# Altium schematic sheet Pre_Amplifier.SchDoc: Pre Amplifier
size A4; DrawnBy: Sem Kirkels; DocumentNumber: 22-23P01S01; Revision: V1; SheetNumber: 1; SheetTotal: 5
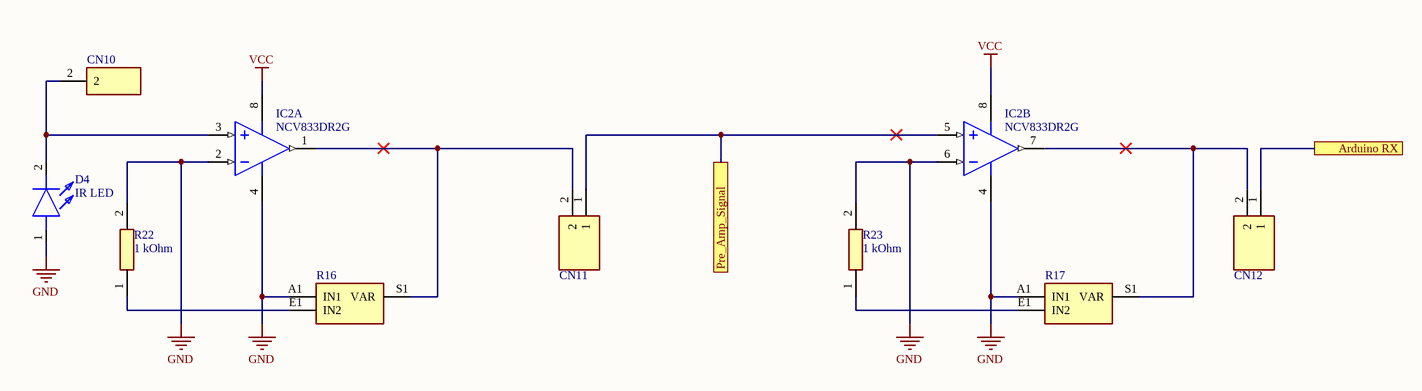
[diagram p0: Pre_Amplifier.SchDoc]

## Parts
CN10  1 Pin Header  [1 PIN HEADER]  (value not drawn)
CN11  2 Pin Header  [2 Pin Header]  (value not drawn)
CN12  2 Pin Header  [2 Pin Header]  (value not drawn)
D4  IR LED  [ELIR204H16L10]
IC2  NCV833DR2G  [Footprint Opamp]  (parts A,B of 2)
R16  PT10LV10-202A2020-S  [Variable resistor]  (value not drawn)
R17  PT10LV10-202A2020-S  [Variable resistor]  (value not drawn)
R22  1 kOhm  [0805]
R23  1 kOhm  [0805]

## Ports
Arduino RX (see CPU[2B]), Pre_Amp_Signal (see Amplifier[1A], Amplifier[1C], Amplifier[2A], Amplifier[2C])

## Nets
GND: D4.1(A) IC2.2(IN1-) IC2.4(VEE) IC2.6(IN2-) R16.A1(IN1) R17.A1(IN1) R22.2 R23.2
VCC: IC2.8(VCC)
Arduino RX: CN12.1 ; port Arduino RX
Pre_Amp_Signal: CN11.1 IC2.5(IN2+) ; port Pre_Amp_Signal
NetCN10_2: CN10.2 D4.2(K) IC2.3(IN1+)
NetCN11_2: CN11.2 IC2.1(OUT1) R16.S1(VAR)
NetCN12_2: CN12.2 IC2.7(OUT2) R17.S1(VAR)
NetR16_E1: R16.E1(IN2) R22.1
NetR17_E1: R17.E1(IN2) R23.1

## Library data of the parts
CN10 = 1 Pin Header: Connector; Manufacturer_Name: TE Connectivity; Manufacturer_Part_Number: 5-146281-1; Datasheet Link: https://www.mouser.com/datasheet/2/418/NG_CD_146281_G1-1238634.pdf; Height: 8.81mm; Mouser Part Number: 571-5-146281-1; Mouser Price/Stock: https://www.mouser.co.uk/ProductDetail/TE-Connectivity/5-146281-1?qs=bwpFY26eRVdQbbdvDiYEig%3D%3D; Arrow Part Number: 5-146281-1; Arrow Price/Stock: https://www.arrow.com/en/products/5-146281-1/te-connectivity
CN11 CN12 = 2 Pin Header: Connector; Manufacturer_Name: TE Connectivity; Manufacturer_Part_Number: 5-146284-2; Datasheet Link: https://componentsearchengine.com/Datasheets/1/5-146284-2.pdf; Height: 8.21mm; Mouser Part Number: 571-5-146284-2; Mouser Price/Stock: https://www.mouser.co.uk/ProductDetail/TE-Connectivity/5-146284-2?qs=26tC0AmtfJgTF4M3cEQgiA%3D%3D; Arrow Part Number: 5-146284-2; Arrow Price/Stock: https://www.arrow.com/en/products/5-146284-2/te-connectivity
D4 = IR LED: LED EL-IR204_H16_L10; Manufacturer_Name: Everlight; Manufacturer_Part_Number: EL-IR204/H16/L10; Datasheet Link: https://www.mouser.de/ProductDetail/Everlight/EL-IR204-H16-L10?qs=vs%252BWWTB4QKYLfZ6uf%2Fu%252B0Q%3D%3D; Height: 7mm; Mouser Part Number: 638-IR204/H16/L10; Mouser Price/Stock: https://www.mouser.co.uk/ProductDetail/Everlight/EL-IR204-H16-L10?qs=vs%252BWWTB4QKYLfZ6uf%2Fu%252B0Q%3D%3D
IC2 = Opamp: Low Noise, Audio Dual Operational Amplifier, -40 to 85 degC, 8-Pin SOIC, Pb-Free, Tape and Reel; Manufacturer: On Semiconductor; SR Typ (V/uS): 7; GBW Typ (MHz): 15; RoHS: TRUE; ComponentLink2URL: http://www.onsemi.cn/pub_link/Collateral/LM833-D.PDF; ComponentLink1Description: Manufacturer URL; ComponentLink3Description: Package Specification; Mounting Technology: Surface Mount; Packing: Tape and Reel; ComponentLink3URL: http://www.onsemi.com/pub_link/Collateral/751-07.PDF; DatasheetVersion: Rev. 6; ComponentLink1URL: http://www.onsemi.com/; PackageDescription: 8-Pin Small Outline Integrated Circuit, Body 4.9 x 3.9 mm, Pitch 1.27 mm; PackageReference: SOIC-8-751-07; PartNumber: NCV833DR2G; PackageVersion: Rev. AK, 02/2011; ComponentLink2Description: Datasheet
R16 R17 = PT10LV10-202A2020-S: Variable Resistor; Manufacturer_Name: PIHER; Datasheet Link: https://www.piher.net/pdf/12-PT10v03.pdf; Height: 6.2mm; Manufacturer_Part_Number: PT10LV10-202A2020-S; Mouser Part Number: 531-PT10V-2K-S; Mouser Price/Stock: https://www.mouser.co.uk/ProductDetail/Amphenol-Piher/PT10LV10-202A2020-S?qs=pCZPOPZMYPhb8H8I5oW3PQ%3D%3D
R22 R23 = Resistor: Manufacturer_Name: YAGEO; Manufacturer_Part_Number: RP0805BRD071KL; Datasheet Link: https://www.yageo.com/upload/media/product/products/datasheet/rchip/PYu-RP_51_RoHS_L_0.pdf; Height: 0.6mm; Mouser Part Number: 603-RP0805BRD071KL; Mouser Price/Stock: https://www.mouser.co.uk/ProductDetail/YAGEO/RP0805BRD071KL?qs=Y0Uzf4wQF3m8mAbG54g63Q%3D%3D